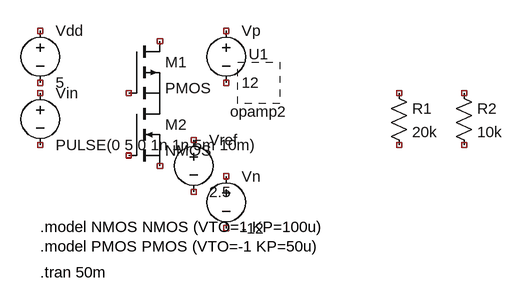
[diagram p0: schematic ltspice_ttl_rs232_final.asc]
ltspice_ttl_rs232_final.asc, the LTspice schematic file:
Version 4
SHEET 1 1200 800

* INPUT SOURCE
SYMBOL voltage 64 128 R0
SYMATTR InstName Vin
SYMATTR Value PULSE(0 5 0 1n 1n 5m 10m)

* VDD
SYMBOL voltage 64 32 R0
SYMATTR InstName Vdd
SYMATTR Value 5

* CMOS INVERTER
SYMBOL pmos 200 64 R0
SYMATTR InstName M1
SYMATTR Value PMOS

SYMBOL nmos 200 160 R0
SYMATTR InstName M2
SYMATTR Value NMOS

* OPAMP
SYMBOL opamp2 400 128 R0
SYMATTR InstName U1

* SUPPLIES
SYMBOL voltage 350 32 R0
SYMATTR InstName Vp
SYMATTR Value 12

SYMBOL voltage 350 256 R0
SYMATTR InstName Vn
SYMATTR Value -12

* REFERENCE
SYMBOL voltage 300 200 R0
SYMATTR InstName Vref
SYMATTR Value 2.5

* DIVIDER
SYMBOL res 600 128 R0
SYMATTR InstName R1
SYMATTR Value 20k

SYMBOL res 700 128 R0
SYMATTR InstName R2
SYMATTR Value 10k

* MODELS
TEXT 64 350 Left 2 !.model NMOS NMOS (VTO=1 KP=100u)
TEXT 64 380 Left 2 !.model PMOS PMOS (VTO=-1 KP=50u)

* SIMULATION
TEXT 64 420 Left 2 !.tran 50m

* NOTE: Connect manually in LTspice:
* Vin -> gates of M1 & M2
* M1 source -> Vdd
* M2 source -> GND
* drains tied -> inv_out -> opamp +
* opamp - -> Vref
* opamp output -> rs232_out -> divider -> final_out

The netlist it stands for:
* ltspice_ttl_rs232_final.asc
Vin NC_01 NC_02 PULSE(0 5 0 1n 1n 5m 10m)
Vdd NC_03 NC_04 5
M1 NC_05 NC_06 P001 P001 PMOS
M2 P001 NC_07 NC_08 NC_08 NMOS
* U1: opamp2 (symbol opamp2 not available, pin order unknown); nets seen at it: 
Vp NC_09 NC_10 12
Vn NC_11 NC_12 -12
Vref NC_13 NC_14 2.5
R1 NC_15 NC_16 20k
R2 NC_17 NC_18 10k
.model NMOS NMOS
.model PMOS PMOS
.lib standard.mos
.model NMOS NMOS (VTO=1 KP=100u)
.model PMOS PMOS (VTO=-1 KP=50u)
.tran 50m
.backanno
.end